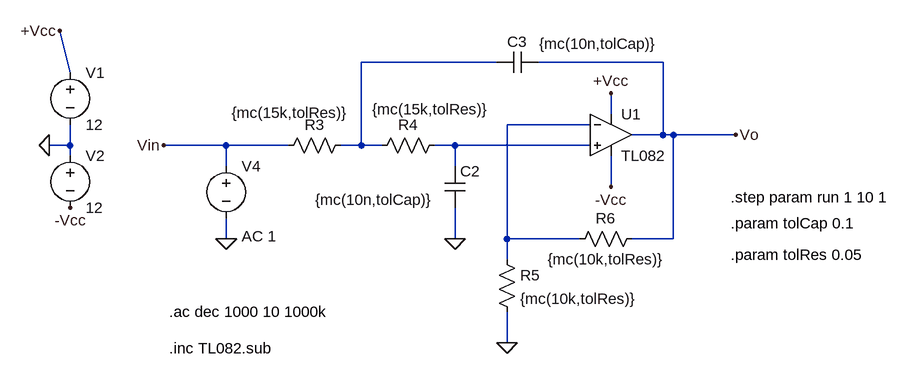
[diagram p0: schematic OpampReal.asc]
OpampReal.asc, the LTspice schematic file:
Version 4
SHEET 1 1152 916
WIRE -672 128 -880 128
WIRE -416 128 -608 128
WIRE -1328 144 -1344 80
WIRE -496 208 -496 176
WIRE -528 224 -656 224
WIRE -416 240 -416 128
WIRE -416 240 -464 240
WIRE -400 240 -416 240
WIRE -304 240 -400 240
WIRE -1328 256 -1328 224
WIRE -1328 256 -1360 256
WIRE -1088 256 -1184 256
WIRE -992 256 -1088 256
WIRE -880 256 -880 128
WIRE -880 256 -912 256
WIRE -848 256 -880 256
WIRE -736 256 -768 256
WIRE -528 256 -736 256
WIRE -1328 272 -1328 256
WIRE -1088 288 -1088 256
WIRE -736 288 -736 256
WIRE -496 320 -496 272
WIRE -1088 400 -1088 368
WIRE -736 400 -736 352
WIRE -656 400 -656 224
WIRE -544 400 -656 400
WIRE -400 400 -400 240
WIRE -400 400 -464 400
WIRE -656 432 -656 400
WIRE -656 560 -656 512
FLAG -1360 256 0
FLAG -1344 80 +Vcc
FLAG -1328 352 -Vcc
FLAG -656 560 0
FLAG -736 400 0
FLAG -1088 400 0
FLAG -304 240 Vo
FLAG -1184 256 Vin
FLAG -496 176 +Vcc
FLAG -496 320 -Vcc
SYMBOL voltage -1328 128 R0
WINDOW 123 0 0 Left 2
WINDOW 39 0 0 Left 2
SYMATTR InstName V1
SYMATTR Value 12
SYMBOL voltage -1328 256 R0
WINDOW 123 0 0 Left 2
WINDOW 39 0 0 Left 2
SYMATTR InstName V2
SYMATTR Value 12
SYMBOL res -896 240 R90
WINDOW 0 0 56 VBottom 2
WINDOW 3 -50 94 VTop 2
SYMATTR InstName R3
SYMATTR Value {mc(15k,tolRes)}
SYMBOL res -752 240 R90
WINDOW 0 0 56 VBottom 2
WINDOW 3 -55 22 VTop 2
SYMATTR InstName R4
SYMATTR Value {mc(15k,tolRes)}
SYMBOL res -672 416 R0
SYMATTR InstName R5
SYMATTR Value {mc(10k,tolRes)}
SYMBOL cap -752 288 R0
WINDOW 3 -199 52 Left 2
SYMATTR InstName C2
SYMATTR Value {mc(10n,tolCap)}
SYMBOL cap -608 112 R90
WINDOW 0 0 32 VBottom 2
WINDOW 3 -28 -93 VTop 2
SYMATTR InstName C3
SYMATTR Value {mc(10n,tolCap)}
SYMBOL voltage -1088 272 R0
WINDOW 123 24 124 Left 2
WINDOW 39 0 0 Left 0
SYMATTR InstName V4
SYMATTR Value ""
SYMATTR Value2 AC 1
SYMBOL res -448 384 R90
WINDOW 0 0 56 VBottom 2
WINDOW 3 32 56 VTop 2
SYMATTR InstName R6
SYMATTR Value {mc(10k,tolRes)}
SYMBOL OpAmps\\opamp2 -496 176 R0
SYMATTR InstName U1
SYMATTR Value TL082
TEXT -1176 568 Left 2 !.inc TL082.sub
TEXT -1176 512 Left 2 !.ac dec 1000 10 1000k
TEXT -312 376 Left 2 !.param tolCap 0.1
TEXT -312 424 Left 2 !.param tolRes 0.05
TEXT -312 336 Left 2 !.step param run 1 10 1

The netlist it stands for:
* OpampReal.asc
V1 +Vcc 0 12
V2 0 -Vcc 12
R3 N001 Vin {mc(15k,tolRes)}
R4 N003 N001 {mc(15k,tolRes)}
R5 N002 0 {mc(10k,tolRes)}
C2 N003 0 {mc(10n,tolCap)}
C3 Vo N001 {mc(10n,tolCap)}
V4 Vin 0 AC 1
R6 Vo N002 {mc(10k,tolRes)}
XU1 N003 N002 +Vcc -Vcc Vo TL082  ; pins In+ In- V+ V- OUT
.inc TL082.sub
.ac dec 1000 10 1000k
.param tolCap 0.1
.param tolRes 0.05
.step param run 1 10 1
.backanno
.end